# Altium schematic sheet CONTROL.SchDoc: CONTROL
size A4; DocumentNumber: 15; Revision: 2.0; SheetNumber: 15; SheetTotal: 18
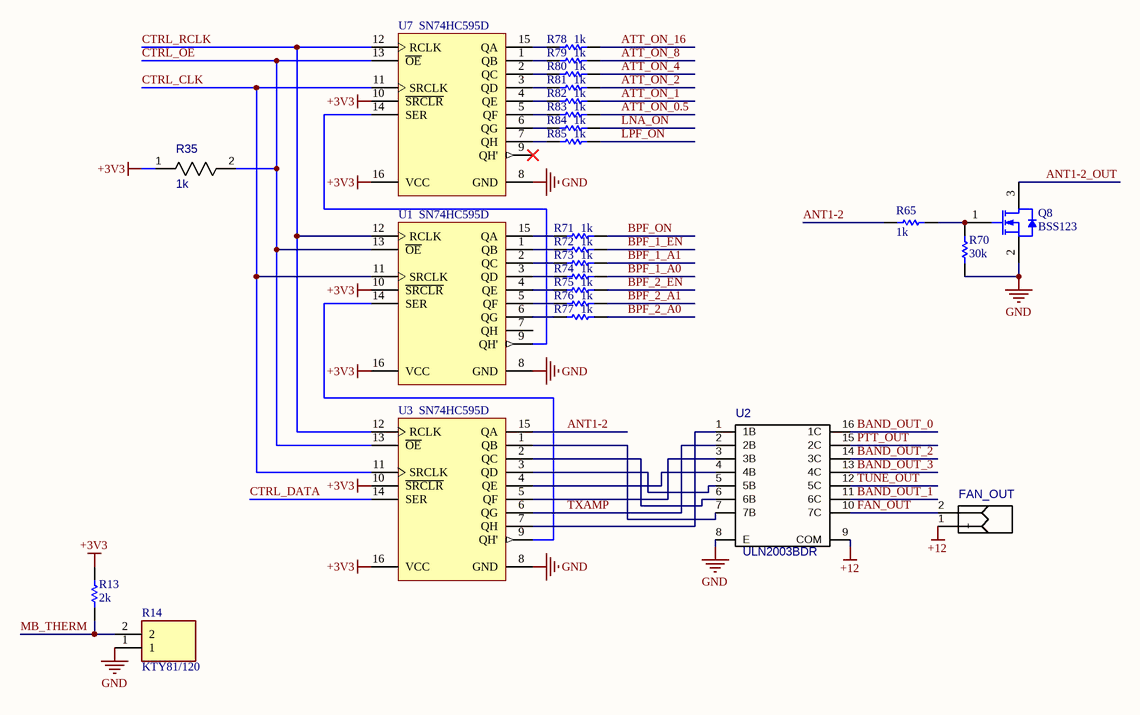
[diagram p0: CONTROL.SchDoc]

## Parts
FAN_OUT  51022-0200  [51022-0200]  (value not drawn)
Q8  BSS123  [FAIR-SOT23-3_V]
R13  2k  [RESC2013X60X40NL20T25]
R14  KTY81/120  [TO254P420X460X770-2P]
R35  1k  [RES_0805]
R65  1k  [RESC2013X60X40NL20T25]
R70  30k  [RESC2013X60X40NL20T25]
R71  1k  [RESC2013X60X40NL20T25]
R72  1k  [RESC2013X60X40NL20T25]
R73  1k  [RESC2013X60X40NL20T25]
R74  1k  [RESC2013X60X40NL20T25]
R75  1k  [RESC2013X60X40NL20T25]
R76  1k  [RESC2013X60X40NL20T25]
R77  1k  [RESC2013X60X40NL20T25]
R78  1k  [RESC2013X60X40NL20T25]
R79  1k  [RESC2013X60X40NL20T25]
R80  1k  [RESC2013X60X40NL20T25]
R81  1k  [RESC2013X60X40NL20T25]
R82  1k  [RESC2013X60X40NL20T25]
R83  1k  [RESC2013X60X40NL20T25]
R84  1k  [RESC2013X60X40NL20T25]
R85  1k  [RESC2013X60X40NL20T25]
U1  SN74HC595D  [D0016A_L]
U2  ULN2003BDR  [ULN2003BDR]
U3  SN74HC595D  [D0016A_L]
U7  SN74HC595D  [D0016A_L]

## Nets
+3V3: R13.1 R35.1 U1.10(~{SRCLR}) U1.16(VCC) U3.10(~{SRCLR}) U3.16(VCC) U7.10(~{SRCLR}) U7.16(VCC)
+12: FAN_OUT.1(+) U2.9(COM)
GND: Q8.2(S) R14.1 R70.1 U1.8(GND) U2.8(E) U3.8(GND) U7.8(GND)
ANT1-2: R65.2 U3.15(QA)
ANT1-2_OUT: Q8.3(D)
ATT_ON_0.5: R83.1
ATT_ON_1: R82.1
ATT_ON_2: R81.1
ATT_ON_4: R80.1
ATT_ON_8: R79.1
ATT_ON_16: R78.1
BAND_OUT_0: U2.16(1C)
BAND_OUT_1: U2.11(6C)
BAND_OUT_2: U2.14(3C)
BAND_OUT_3: U2.13(4C)
BPF_1_A0: R74.1
BPF_1_A1: R73.1
BPF_1_EN: R72.1
BPF_2_A0: R77.1
BPF_2_A1: R76.1
BPF_2_EN: R75.1
BPF_ON: R71.1
CTRL_CLK: U1.11(SRCLK) U3.11(SRCLK) U7.11(SRCLK)
CTRL_DATA: U3.14(SER)
CTRL_OE: R35.2 U1.13(~{OE}) U3.13(~{OE}) U7.13(~{OE})
CTRL_RCLK: U1.12(RCLK) U3.12(RCLK) U7.12(RCLK)
FAN_OUT: FAN_OUT.2(-) U2.10(7C)
LNA_ON: R84.1
LPF_ON: R85.1
MB_THERM: R13.2 R14.2
PTT_OUT: U2.15(2C)
TUNE_OUT: U2.12(5C)
TXAMP: U2.2(2B) U3.6(QG)
NetQ8_1: Q8.1(G) R65.1 R70.2
NetR71_2: R71.2 U1.15(QA)
NetR72_2: R72.2 U1.1(QB)
NetR73_2: R73.2 U1.2(QC)
NetR74_2: R74.2 U1.3(QD)
NetR75_2: R75.2 U1.4(QE)
NetR76_2: R76.2 U1.5(QF)
NetR77_2: R77.2 U1.6(QG)
NetR78_2: R78.2 U7.15(QA)
NetR79_2: R79.2 U7.1(QB)
NetR80_2: R80.2 U7.2(QC)
NetR81_2: R81.2 U7.3(QD)
NetR82_2: R82.2 U7.4(QE)
NetR83_2: R83.2 U7.5(QF)
NetR84_2: R84.2 U7.6(QG)
NetR85_2: R85.2 U7.7(QH)
NetU1_9: U1.9(QH') U7.14(SER)
NetU1_14: U1.14(SER) U3.9(QH')
NetU2_1: U2.1(1B) U3.7(QH)
NetU2_3: U2.3(3B) U3.5(QF)
NetU2_4: U2.4(4B) U3.4(QE)
NetU2_5: U2.5(5B) U3.3(QD)
NetU2_6: U2.6(6B) U3.2(QC)
NetU2_7: U2.7(7B) U3.1(QB)

Not connected (* = marked no-connect by the designer): U1 7(QH); U7 9(QH')*

## Notes on the sheet
- Title
- Size:
- Date:
- A4
- Number:
- Time:
- Revision:
- Sheet
- of
- File:

## Library data of the parts
Q8 = CMP-2000-04934-1: N-Channel Logic Level Enhancement Mode Field Effect Transistor, 1.7 V, -55 to 150 degC, 3-Pin SOT-23, RoHS, Tape and Reel; Manufacturer: Fairchild; Channel Type: N; Typical Turn-Off Delay Time: 17ns; Maximum Continuous Drain Current: 0.17A; Rad Hard: No; Typical Rise Time: 9ns; Typical Fall Time: 2.4ns; Maximum Gate Source Voltage: ±20V; Maximum Drain Source Voltage: 100V; Typical Turn-On Delay Time: 1.7ns; RDS-on: 6000@10VmOhm; Package Version: Rev. 12, 03/2016; Packaging: Tape&Reel; Package Reference: SOT23-3; Channel Mode: Enhancement; Operating Temperature: -55to150degC; Package Description: 3-Pin Small Outline Transistor, Body 2.92 x 1.325 mm, Pitch 0.95 mm; Category: MOSFET; Datasheet Version: Jun-03; Datasheet URL: https://www.fairchildsemi.com/datasheets/BS/BSS123.pdf; Manufacturer URL: https://www.fairchildsemi.com/; Mounting: SurfaceMount; Package: 3SOT-23; Package URL: http://www.fairchildsemi.com/dwg/MA/MA03D.pdf
R13 R65 R70-R85 = CMP-2001-00626-1: RES_0805; Manufacturer: Panasonic; Part Number: ERA-6AEB303V
R14 = KTY81_110: Integrated Circuit; Manufacturer_Name: Nexperia; Manufacturer_Part_Number: KTY81/110; Datasheet Link: https://www.nxp.com/docs/en/data-sheet/KTY81_SER.pdf; Height: 4.2mm
R35 = RES_0805: Value: 1k
U1 U3 U7 = CMP-0780-00038-3: 8-Bit Shift Registers With 3-State Output Registers, D0016A, TUBE; Manufacturer: Texas Instruments; Bits: 8; F @ Nom Voltage(Max)(Mhz): 28; Voltage(Nom)(V): 6; ICC @ Nom Voltage(Max)(mA): 0.08; Output Drive (IOL/IOH)(Max)(mA): 7.8/-7.8; tpd @ Nom Voltage(Max)(ns): 34; 3-State Output: Yes; VCC(Min)(V): 2; Output Type: CMOS; Technology Family: HC; Rating: Military; Generic Part Number: SN74HC595; PackageReference: D0016A; Code_JEDEC: MS-012 variation AC; Operating Temperature Range(C): -40 to 85; VCC(Max)(V): 6; DatasheetVersion: SCLS041H; Input Type: CMOS; PackageVersion: http://www.ti.com/lit/ml/mpds178g/mpds178g.pdf
U2 = ULN2003BDR: Value: *